# Altium schematic sheet Display.SchDoc
size A4
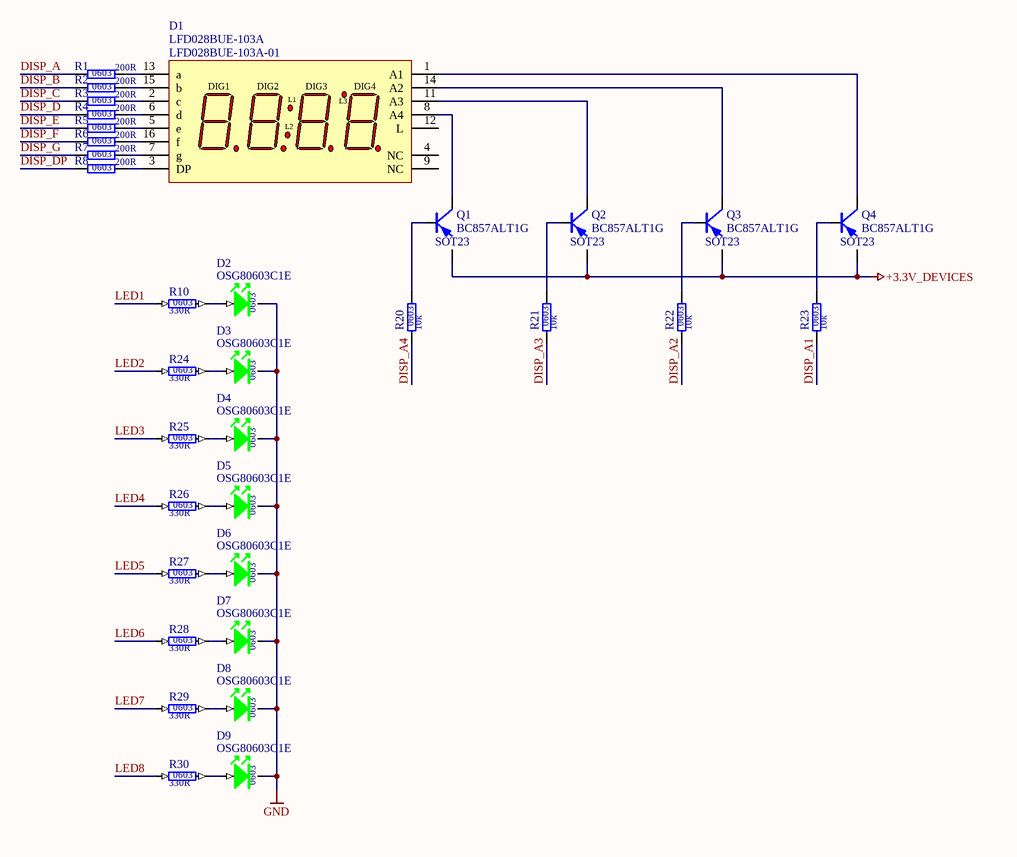
[diagram p0: Display.SchDoc]

## Parts
D1  value LFD028BUE-103A-01  SCH_Footprint: LFD028BUE-103A  [LFD028BUE-103A-01]  (hidden comment: 4x7 SEG 0.28')
D2  value OSG80603C1E  SCH_Footprint: 0603  [OL_0603_1608]  (hidden comment: Green led)
D3  value OSG80603C1E  SCH_Footprint: 0603  [OL_0603_1608]  (hidden comment: Green led)
D4  value OSG80603C1E  SCH_Footprint: 0603  [OL_0603_1608]  (hidden comment: Green led)
D5  value OSG80603C1E  SCH_Footprint: 0603  [OL_0603_1608]  (hidden comment: Green led)
D6  value OSG80603C1E  SCH_Footprint: 0603  [OL_0603_1608]  (hidden comment: Green led)
D7  value OSG80603C1E  SCH_Footprint: 0603  [OL_0603_1608]  (hidden comment: Green led)
D8  value OSG80603C1E  SCH_Footprint: 0603  [OL_0603_1608]  (hidden comment: Green led)
D9  value OSG80603C1E  SCH_Footprint: 0603  [OL_0603_1608]  (hidden comment: Green led)
Q1  SCH_Footprint: SOT23  [SOT23_TO236_SC59]  (hidden comment: BC857ALT1G)
Q2  SCH_Footprint: SOT23  [SOT23_TO236_SC59]  (hidden comment: BC857ALT1G)
Q3  SCH_Footprint: SOT23  [SOT23_TO236_SC59]  (hidden comment: BC857ALT1G)
Q4  SCH_Footprint: SOT23  [SOT23_TO236_SC59]  (hidden comment: BC857ALT1G)
R1  value 200R  SCH_Footprint: 0603  [R_0603_1608]  (hidden comment: Resistor)
R2  value 200R  SCH_Footprint: 0603  [R_0603_1608]  (hidden comment: Resistor)
R3  value 200R  SCH_Footprint: 0603  [R_0603_1608]  (hidden comment: Resistor)
R4  value 200R  SCH_Footprint: 0603  [R_0603_1608]  (hidden comment: Resistor)
R5  value 200R  SCH_Footprint: 0603  [R_0603_1608]  (hidden comment: Resistor)
R6  value 200R  SCH_Footprint: 0603  [R_0603_1608]  (hidden comment: Resistor)
R7  value 200R  SCH_Footprint: 0603  [R_0603_1608]  (hidden comment: Resistor)
R8  value 200R  SCH_Footprint: 0603  [R_0603_1608]  (hidden comment: Resistor)
R10  value 330R  SCH_Footprint: 0603  [R_0603_1608]  (hidden comment: Resistor)
R20  value 10k  SCH_Footprint: 0603  [R_0603_1608]  (hidden comment: Resistor)
R21  value 10k  SCH_Footprint: 0603  [R_0603_1608]  (hidden comment: Resistor)
R22  value 10k  SCH_Footprint: 0603  [R_0603_1608]  (hidden comment: Resistor)
R23  value 10k  SCH_Footprint: 0603  [R_0603_1608]  (hidden comment: Resistor)
R24  value 330R  SCH_Footprint: 0603  [R_0603_1608]  (hidden comment: Resistor)
R25  value 330R  SCH_Footprint: 0603  [R_0603_1608]  (hidden comment: Resistor)
R26  value 330R  SCH_Footprint: 0603  [R_0603_1608]  (hidden comment: Resistor)
R27  value 330R  SCH_Footprint: 0603  [R_0603_1608]  (hidden comment: Resistor)
R28  value 330R  SCH_Footprint: 0603  [R_0603_1608]  (hidden comment: Resistor)
R29  value 330R  SCH_Footprint: 0603  [R_0603_1608]  (hidden comment: Resistor)
R30  value 330R  SCH_Footprint: 0603  [R_0603_1608]  (hidden comment: Resistor)

## Nets
+3.3V_DEVICES: Q1.2(E) Q2.2(E) Q3.2(E) Q4.2(E)
GND: D2.1(K) D3.1(K) D4.1(K) D5.1(K) D6.1(K) D7.1(K) D8.1(K) D9.1(K)
DISP_A: R1.1
DISP_A1: R23.1
DISP_A2: R22.1
DISP_A3: R21.1
DISP_A4: R20.1
DISP_B: R2.1
DISP_C: R3.1
DISP_D: R4.1
DISP_DP: R8.1
DISP_E: R5.1
DISP_F: R6.1
DISP_G: R7.1
LED1: R10.1
LED2: R24.1
LED3: R25.1
LED4: R26.1
LED5: R27.1
LED6: R28.1
LED7: R29.1
LED8: R30.1
NetD1_1: D1.1(A1) Q4.3(C)
NetD1_2: D1.2(c) R3.2
NetD1_3: D1.3(DP) R8.2
NetD1_5: D1.5(e) R5.2
NetD1_6: D1.6(d) R4.2
NetD1_7: D1.7(g) R7.2
NetD1_8: D1.8(A4) Q1.3(C)
NetD1_11: D1.11(A3) Q2.3(C)
NetD1_13: D1.13(a) R1.2
NetD1_14: D1.14(A2) Q3.3(C)
NetD1_15: D1.15(b) R2.2
NetD1_16: D1.16(f) R6.2
NetD2_2: D2.2(A) R10.2
NetD3_2: D3.2(A) R24.2
NetD4_2: D4.2(A) R25.2
NetD5_2: D5.2(A) R26.2
NetD6_2: D6.2(A) R27.2
NetD7_2: D7.2(A) R28.2
NetD8_2: D8.2(A) R29.2
NetD9_2: D9.2(A) R30.2
NetQ1_1: Q1.1(B) R20.2
NetQ2_1: Q2.1(B) R21.2
NetQ3_1: Q3.1(B) R22.2
NetQ4_1: Q4.1(B) R23.2

Not connected (* = marked no-connect by the designer): D1 4(NC) 9(NC) 12(L)

## Notes on the sheet
- (in symbol OL_LFD028BUE-103A-01) DIG1; DIG2; DIG3; DIG4; L1; L3; L2

## Library data of the parts
D1 = OL_LFD028BUE-103A-01: Manufacturer: WENRUN; Part Number: OL_LFD028BUE-103A-01; HelpURL: https://www.tme.eu/pl/Document/afe40de6cbe93d7d978749835d83cb6c/LFD028BUE-103A.pdf; Manufacturer Part Number: LFD028BUE-103A-01; Supplier 1: TME; Supplier Part Number 1: LFD028BUE-103A-01; Supplier 2: RS Components; Supplier 3: Farnell; Supplier 4: Mouser; Supplier 5: Digi-Key
D2-D9 = OL_G_0603_OSG80603C1E: LED GREEN; Manufacturer: Optosupply; Part Number: OL_G_0603_OSG80603C1E; Manufacturer Part Number: OSG80603C1E; Supplier 1: TME; Supplier Part Number 1: OSG80603C1E; Supplier 2: RS Components; Supplier 3: Farnell; Supplier 4: Mouser; Supplier 5: Digi-Key
Q1-Q4 = QPN_BC857ALT1G: Transitor PNP; Manufacturer: ON Semiconductor; Voltage: 45V; Current: 100mA; Value: BC857ALT1G; Part Number: QPN_BC857ALT1G; Type: PNP; HelpURL: https://datasheet.octopart.com/BC857ALT1G-ON-Semiconductor-datasheet-522530.pdf; Manufacturer Part Number: BC857ALT1G; Supplier 1: TME; Supplier Part Number 1: BC857ALT1G; Supplier 2: RS Components; Supplier Part Number 2: 8009658P; Supplier 3: Farnell; Supplier Part Number 3: 2440801; Supplier 4: Mouser; Supplier Part Number 4: 863-BC857ALT1G; Supplier 5: Digi-Key; Supplier Part Number 5: BC857ALT1GOSCT-ND
R1-R8 = R_200R_0603_1: Manufacturer: Royalohm; Manufacturer Part Number: 0603SAF2000T5E; Voltage: 50V; Power: 100mW; Tolerance: 1%; Part Number: R_200R_0603_1; HelpURL: http://www.tme.eu/pl/Document/b315665a56acbc42df513c99b390ad98/ROYALOHM-THICKFILM.pdf; Supplier 1: TME; Supplier Part Number 1: SMD0603-200R-1%; Supplier 2: RS Components; Supplier 3: Farnell; Supplier 4: Mouser; Supplier Part Number 4: 667-ERJ-3EKF2000V; Supplier 5: Digi-Key; Supplier Part Number 5: P200HCT-ND
R10 R24-R30 = R_330R_0603_1: Manufacturer: Yageo; Manufacturer Part Number: RC0603FR-07330RL; Voltage: 50V; Power: 100mW; Tolerance: 1%; Part Number: R_330R_0603_1; HelpURL: http://datasheet.octopart.com/RC0603FR-07330RL-Yageo-datasheet-8328172.pdf; Supplier 1: TME; Supplier Part Number 1: RC0603FR-07330R; Supplier 2: RS Components; Supplier Part Number 2: 5046499; Supplier 3: Farnell; Supplier Part Number 3: 9238425; Supplier 4: Mouser; Supplier Part Number 4: 603-RC0603FR-07330RL; Supplier 5: Digi-Key; Supplier Part Number 5: 311-330HRCT-ND
R20-R23 = R_10k_0603_1: Manufacturer: Vishay; Manufacturer Part Number: CRCW060310K0FKTABC; Voltage: 75V; Power: 100mW; Tolerance: 1%; Part Number: R_10k_0603_1; HelpURL: http://www.tme.eu/pl/Document/622e28308c06d160637f2b14751ba16b/Data%20Sheet%20CRCW_BCe3.pdf; Supplier 1: TME; Supplier Part Number 1: CRCW060310K0FKTABC; Supplier 2: RS Components; Supplier 3: Farnell; Supplier 4: Mouser; Supplier Part Number 4: 667-ERJ-3EKF1002V; Supplier 5: Digi-Key; Supplier Part Number 5: P10KGCT-ND